# EAGLE design job17 (EAGLE 6.0)
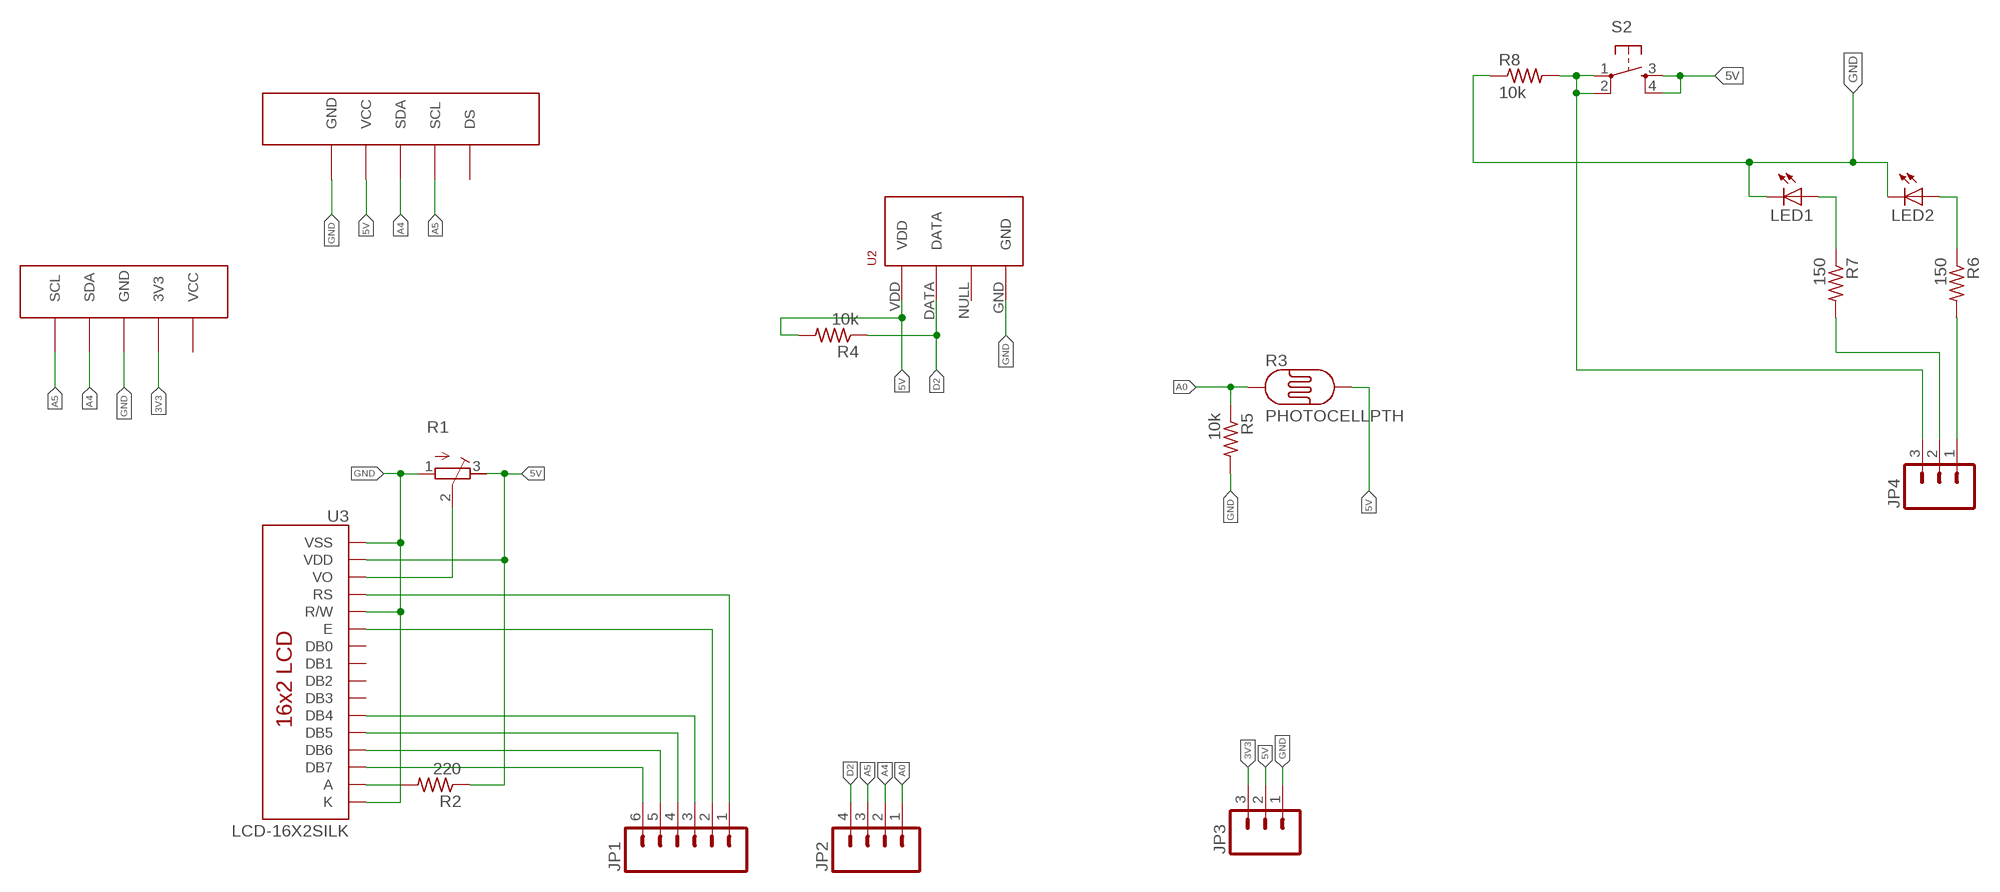
[diagram p0: schematic, sheet 1]

## Parts
JP1  M06SIP  [1X06]
JP2  M04PTH  [1X04]
JP3  M03PTH  [1X03]
JP4  M03PTH  [1X03]
LED1  LED5MM  [LED5MM]
LED2  LED5MM  [LED5MM]
R1  R-TRIMM3339P  [RTRIM3339P]
R2  220  R-US_0207/10  [0207/10]
R3  PHOTOCELLPTH  [PHOTOCELL]
R4  10k  R-US_0207/10  [0207/10]
R5  10k  R-US_0207/10  [0207/10]
R6  150  R-US_0207/10  [0207/10]
R7  150  R-US_0207/10  [0207/10]
R8  10k  R-US_0207/10  [0207/10]
RTC1  TINY_RTC  [TINY_RTC]
S1  BMP085  [BMP085]
S2  TAC_SWITCHPTH  [TACTILE-PTH]
U2  RHT03_DHT-22_AM2302RA  [RHT03_DHT-22/RA]
U3  LCD-16X2SILK  [LCD-16X2]

## Nets
3V3: JP3.3 S1.3V3
5V: JP3.2 R1.3(E) R2.1 R3.2 R4.2 RTC1.VCC S2.3 S2.4 U2.VDD U3.2(VDD)
A0: JP2.1 R3.1 R5.1
A4: JP2.2 RTC1.SDA S1.SDA
A5: JP2.3 RTC1.SCL S1.SCL
D2: JP2.4 R4.1 U2.DATA
D22: JP4.1 R6.2
D24: JP4.2 R7.2
D26: JP4.3 R8.2 S2.1 S2.2
GND: JP3.1 LED1.K(C) LED2.K(C) R1.1(A) R5.2 R8.1 RTC1.GND S1.GND U2.GND U3.1(VSS) U3.5(R/W) U3.16(K)
N$1: JP1.6 U3.14(DB7)
N$2: JP1.5 U3.13(DB6)
N$3: R1.2(S) U3.3(VO)
N$4: R2.2 U3.15(A)
N$5: JP1.4 U3.12(DB5)
N$6: JP1.3 U3.11(DB4)
N$7: JP1.2 U3.6(E)
N$8: JP1.1 U3.4(RS)
N$11: LED1.A R7.1
N$12: LED2.A R6.1
Unconnected: RTC1.DS S1.VCC U2.NULL U3.7(DB0) U3.8(DB1) U3.9(DB2) U3.10(DB3)

## Library data of the parts
JP1 = SparkFun-Connectors:M06: Header 6 Standard 6-pin 0.1" header. Use with straight break away headers (SKU : PRT-00116), right angle break away headers (PRT-00553), swiss pins (PRT-00743), machine pins (PRT-00117), and female headers (PRT-00115). Molex polarized connector foot print use with SKU : PRT-08094 with associated crimp pins and housings. NOTES ON THE VARIANTS LOCK and LOCK_LONGPADS... This footprint was designed to help hold the alignment of a through-hole component (i.e. 6-pin header) while soldering it into place. You may notice that each hole has been shifted either up or down by 0.005 of an inch from it's more standard position (which is a perfectly straight line). This slight alteration caused the pins (the squares in the middle) to touch the edges of the holes. Because they are alternating, it causes a "brace" to hold the component in place. 0.005 has proven to be the perfect amount of "off-center" position when using our standard breakaway headers. Although looks a little odd when you look at the bare footprint, once you have a header in there, the alteration is very hard to notice. Also, if you push a header all the way into place, it is covered up entirely on the bottom side. This idea of altering the position of holes to aid alignment will be further integrated into the Sparkfun Library for other footprints. It can help hold any component with 3 or more connection pins.
JP2 = SparkFun-Connectors:M04: Header 4 Standard 4-pin 0.1" header. Use with straight break away headers (SKU : PRT-00116), right angle break away headers (PRT-00553), swiss pins (PRT-00743), machine pins (PRT-00117), and female headers (PRT-00115). Molex polarized connector foot print use with SKU : PRT-08231 with associated crimp pins and housings. 1MM SMD Version SKU: PRT-10208
JP3 JP4 = SparkFun-Connectors:M03: Header 3 Standard 3-pin 0.1" header. Use with straight break away headers (SKU : PRT-00116), right angle break away headers (PRT-00553), swiss pins (PRT-00743), machine pins (PRT-00117), and female headers (PRT-00115). Molex polarized connector foot print use with SKU : PRT-08232 with associated crimp pins and housings.
LED1 LED2 = adafruit:LED: LED OSRAM: - CHIPLED LG R971, LG N971, LY N971, LG Q971, LY Q971, LO R971, LY R971 LH N974, LH R974 LS Q976, LO Q976, LY Q976 LO Q996 - Hyper CHIPLED LW Q18S LB Q993, LB Q99A, LB R99A - SideLED LS A670, LO A670, LY A670, LG A670, LP A670 LB A673, LV A673, LT A673, LW A673 LH A674 LY A675 LS A676, LA A676, LO A676, LY A676, LW A676 LS A679, LY A679, LG A679 - Hyper Micro SIDELED® LS Y876, LA Y876, LO Y876, LY Y876 LT Y87S - SmartLED LW L88C, LW L88S LB L89C, LB L89S, LG L890 LS L89K, LO L89K, LY L89K LS L896, LA L896, LO L896, LY L896 - TOPLED LS T670, LO T670, LY T670, LG T670, LP T670 LSG T670, LSP T670, LSY T670, LOP T670, LYG T670 LG T671, LOG T671, LSG T671 LB T673, LV T673, LT T673, LW T673 LH T674 LS T676, LA T676, LO T676, LY T676, LB T676, LH T676, LSB T676, LW T676 LB T67C, LV T67C, LT T67C, LS T67K, LO T67K, LY T67K, LW E67C LS E67B, LA E67B, LO E67B, LY E67B, LB E67C, LV E67C, LT E67C LW T67C LS T679, LY T679, LG T679 LS T770, LO T770, LY T770, LG T770, LP T770 LB T773, LV T773, LT T773, LW T773 LH T774 LS E675, LA E675, LY E675, LS T675 LS T776, LA T776, LO T776, LY T776, LB T776 LHGB T686 LT T68C, LB T68C - Hyper Mini TOPLED® LB M676 - Mini TOPLED Santana® LG M470 LS M47K, LO M47K, LY M47K Source: http://www.osram.convergy.de/
R1 = rcl:R-TRIMM: Trimm resistor
R2 R4-R8 = rcl:R-US_: RESISTOR, American symbol
R3 = SparkFun-Sensors:PHOTOCELL: CdS photoresistor. This is a low cost way to detect light levels. Resistance decreases with more incoming light. SparkFun SKU: SEN-09088
RTC1 = job17:TINY_RTC
S1 = job17:BMP085
S2 = SparkFun-Electromechanical:TAC_SWITCH: Momentary Switch Button commonly used for reset or general input. Spark Fun Electronics SKU : COM-00097 SMT- SWCH-08247
U2 = RHT03_DHT-22_AM2302:RHT03_DHT-22_AM2302: RHT03 / DHT-22 / AM2302 Packages and symbol for the RHT03 / DHT-22 relative humidity and temperature sensor. Note: The AM2302 is a wired version of the DHT-22 which typically requires less clearance and is thus provided as a separate package.; PROD_ID: SEN-10167
U3 = SparkFun-MY-Displays:LCD-16X2: Standard text-only 16x2 parallel input LCD

## Board
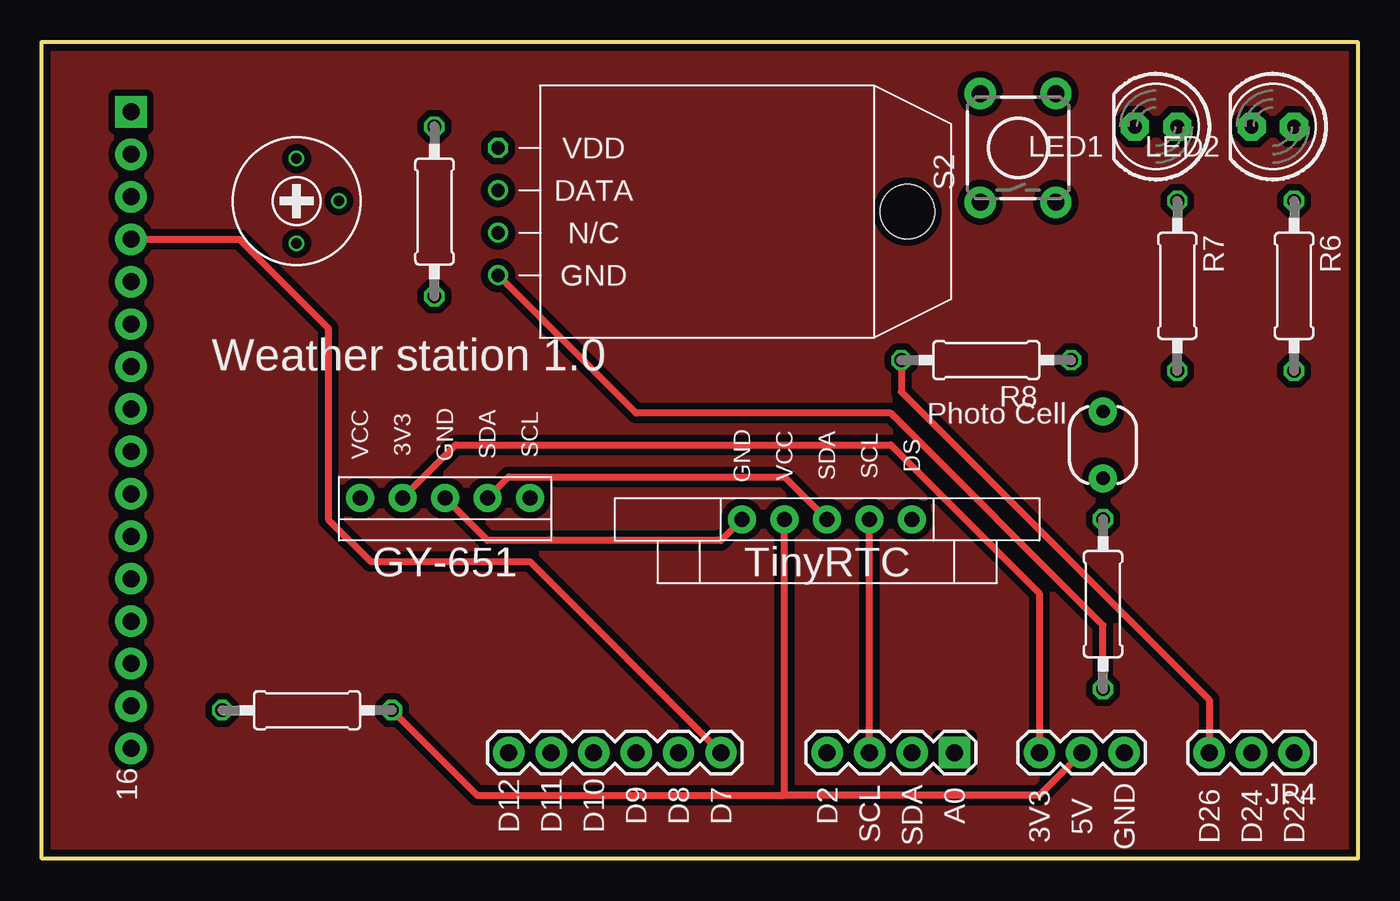
[diagram p1: board, top side]
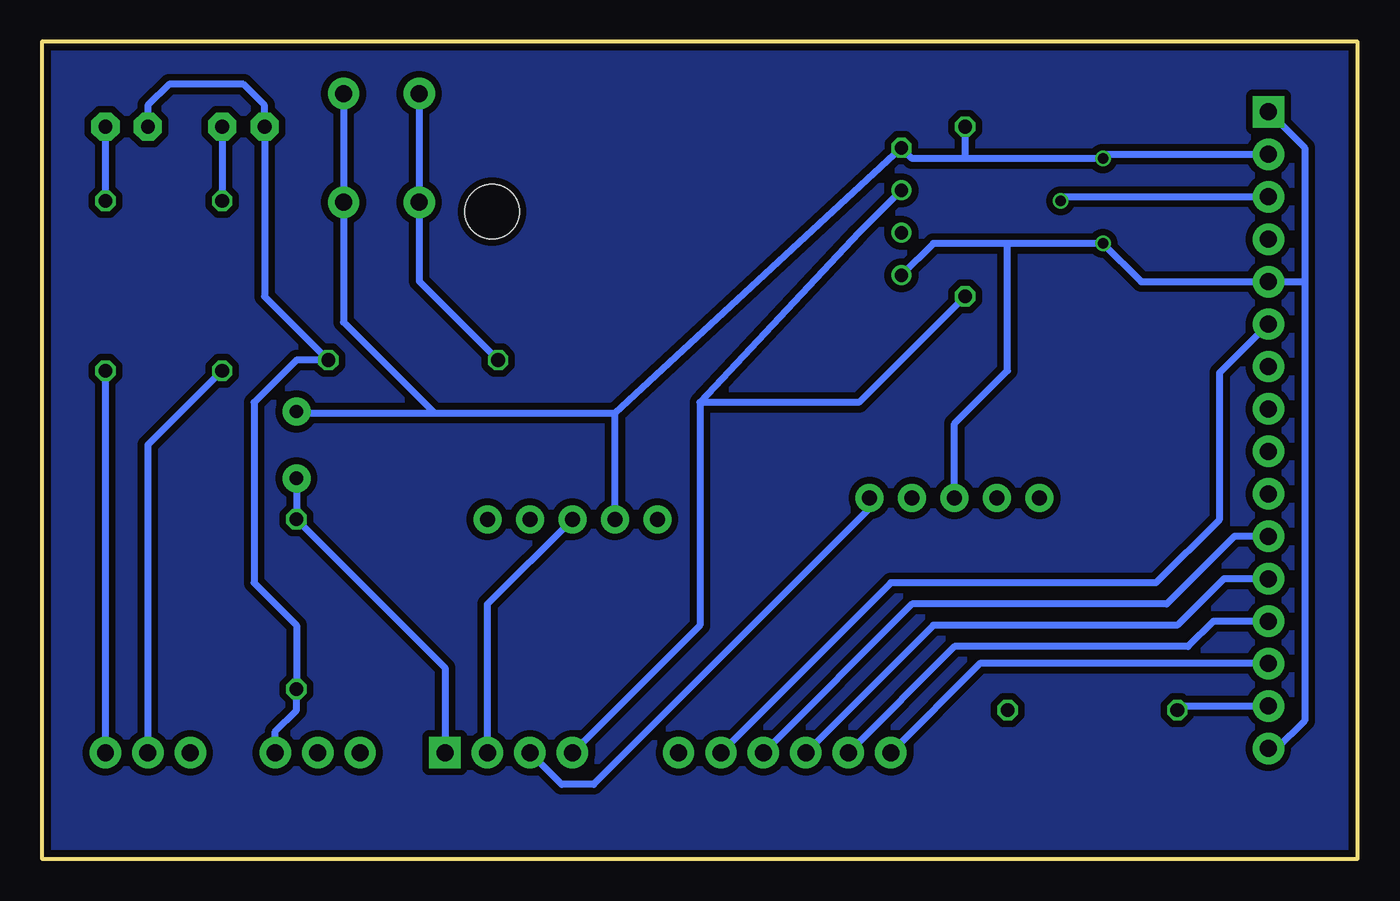
[diagram p2: board, bottom side, seen from below]

Size 78.74 x 48.9 mm. Coordinates in mm from the lower left corner, seen from the top.
Outline: 0,0 0,48.9 78.74,48.9 78.74,0 0,0
Copper layers (1*16): Top 0.035mm / dielectric 0.2mm / Bottom 0.035mm
Design rules: minimum track width 6mil, minimum drill 12mil, track to track 6mil, track to pad 6mil, pad to pad 6mil, via to via 6mil, smd to smd 0mil, copper to edge 10mil, drill to drill 10mil, minimum pad ring 6mil, minimum via ring 6mil, stop-mask expansion 2mil, vias tented up to drill 25mil, thermal gap 10mil

### Footprints (pad centres in the part's own frame; a part is rotated, then mirrored left to right if it is on the bottom)
1X06 = drill 1.016 pad 1.88: 1 0,0; 2 2.54,0; 3 5.08,0; 4 7.62,0; 5 10.16,0; 6 12.7,0
1X04 = drill 1.016 pad 1.88 square: 1 0,0 | drill 1.016 pad 1.88: 2 2.54,0; 3 5.08,0; 4 7.62,0
1X03 = drill 1.016 pad 1.88: 1 0,0; 2 2.54,0; 3 5.08,0
LED5MM = drill 0.813 pad 1.676 octagon: A -1.27,0; K 1.27,0
RTRIM3339P = drill 0.61: 1 -2.54,0; 2 0,-2.54; 3 2.54,0
0207/10 = drill 0.813 octagon: 1 -5.08,0; 2 5.08,0
PHOTOCELL = drill 0.8 pad 1.676: 1 -2,0; 2 2,0
TINY_RTC = drill 0.9 pad 1.676: DS 0,-5.08; GND 0,5.08; SCL 0,-2.54; SDA 0,0; VCC 0,2.54
BMP085 = drill 0.9 pad 1.676: 3V3 0,-2.54; GND 0,0; SCL 0,5.08; SDA 0,2.54; VCC 0,-5.08
TACTILE-PTH = drill 1.016 pad 1.88: 1 -3.251,2.261; 2 3.251,2.261; 3 -3.251,-2.261; 4 3.251,-2.261
RHT03_DHT-22/RA = drill 0.8: DATA -1.27,0; GND 3.81,0; NULL 1.27,0 | drill 0.8 octagon: VDD -3.81,0 | hole 3.25: 0,24.5
LCD-16X2 = drill 1.016 pad 1.88 square: 1 -32,15.5 | drill 1.016 pad 1.88: 2 -29.46,15.5; 3 -26.92,15.5; 4 -24.38,15.5; 5 -21.84,15.5; 6 -19.3,15.5; 7 -16.76,15.5; 8 -14.22,15.5; 9 -11.68,15.5; 10 -9.14,15.5; 11 -6.6,15.5; 12 -4.06,15.5; 13 -1.52,15.5; 14 1.02,15.5; 15 3.56,15.5; 16 6.1,15.5

### Placement (x,y rotation side)
JP1  40.64,6.35 180 top
JP2  54.61,6.35 180 top
JP3  64.77,6.35 180 top
JP4  74.93,6.35 180 top
LED1  66.67,43.81 180 top
LED2  73.66,43.81 180 top
R1  15.24,39.37 90 top
R2  15.88,8.89 180 top
R3  63.5,24.77 90 top
R4  23.5,38.73 90 top
R5  63.5,15.24 270 top
R6  74.93,34.29 270 top
R7  67.94,34.29 270 top
R8  56.52,29.84 180 top
RTC1  46.99,20.32 90 top
S1  24.13,21.59 270 top
S2  58.42,42.55 90 top
U2  27.3,38.73 270 top
U3  -10.16,12.7 270 top

### Tracks (layer width: path | path; a pad name or v marks a point on that pad's centre or on a via)
3V3
  Top 0.406: S1.3V3 24.77,24.77 50.8,24.77 59.69,15.88 JP3.3
5V
  Top 0.406: R2.1 26.04,3.81 44.45,3.81 | 44.45,3.81 RTC1.VCC | JP3.2 59.69,3.81 44.45,3.81
  Bottom 0.406: RTC1.VCC 44.45,26.67 | 44.45,26.67 U2.VDD 26.67,41.91 23.5,41.91 | U3.2 14.99,42.16 R1.3 23.5,41.91 | R4.2 23.5,41.91 | R3.2 63.41,26.67 55.24,26.67 | 55.24,26.67 44.45,26.67 | S2.4 S2.3 60.68,32.11 55.24,26.67
A0
  Bottom 0.406: R3.1 R5.1 54.61,11.43 JP2.1
A4
  Top 0.406: S1.SDA 27.94,22.86 44.45,22.86 RTC1.SDA
  Bottom 0.406: JP2.2 52.07,15.24 RTC1.SDA
A5
  Top 0.406: JP2.3 RTC1.SCL
  Bottom 0.406: S1.SCL 29.21,20.95 45.72,4.45 47.62,4.45 JP2.3
D2
  Bottom 0.406: U2.DATA 29.84,37.47 39.37,27.3 | 39.37,27.3 39.37,13.97 JP2.4 | R4.1 29.84,27.3 39.37,27.3
D22
  Bottom 0.406: R6.2 JP4.1
D24
  Bottom 0.406: R7.2 72.39,24.77 JP4.2
D26
  Top 0.406: R8.2 51.44,27.94 69.85,9.53 JP4.3
  Bottom 0.406: S2.2 S2.1 56.16,34.57 R8.2
GND
  Top 0.406: RTC1.GND 40.64,19.05 26.67,19.05 S1.GND | R5.2 63.5,13.97 50.8,26.67 35.56,26.67 U2.GND
  Bottom 0.406: 20.95,36.83 R1.1 12.95,34.54 U3.5 3.17,34.54 | 20.95,36.83 25.4,36.83 U2.GND | JP3.1 64.77,7.62 63.5,8.89 R5.2 63.5,13.97 66.04,16.51 66.04,27.3 63.5,29.84 R8.1 65.41,33.66 LED1.K 65.41,45.09 66.67,46.35 71.12,46.35 72.39,45.09 LED2.K | S1.GND 24.13,26.04 20.95,29.21 20.95,36.83 | U3.1 3.17,42.55 3.17,34.54 | 3.17,34.54 3.17,8.26 4.83,6.6 U3.16
N$1
  Bottom 0.406: JP1.6 22.61,11.68 U3.14
N$2
  Bottom 0.406: JP1.5 24.13,12.7 10.16,12.7 8.64,14.22 U3.13
N$3
  Bottom 0.406: R1.2 17.53,39.62 U3.3
N$4
  Bottom 0.406: R2.2 10.54,9.14 U3.15
N$5
  Bottom 0.406: JP1.4 25.4,13.97 10.79,13.97 8.01,16.76 U3.12
N$6
  Bottom 0.406: JP1.3 26.67,15.24 11.43,15.24 7.37,19.3 U3.11
N$7
  Bottom 0.406: JP1.2 27.94,16.51 12.06,16.51 8.26,20.32 8.26,29.09 U3.6
N$8
  Top 0.406: JP1.1 29.21,17.78 19.68,17.78 17.14,20.32 17.14,31.75 11.81,37.08 U3.4
N$9
  pour Top (isolate 0.406): 0,48.9 78.74,48.9 78.74,0 0,0
N$10
  pour Bottom (isolate 0.406): 0,48.9 78.74,48.9 78.74,0 0,0
N$11
  Bottom 0.406: LED1.A R7.1
N$12
  Bottom 0.406: LED2.A R6.1

### Text on the board
tPlace: VDD | DATA | N/C | GND | Weather station 1.0 | Photo Cell | GY-651 | TinyRTC | 16 | SCL | SDA | D12 | D11 | D10 | D9 | D8 | D7 | D2 | A0 | 3V3 | 5V | GND | D26 | D24 | D22